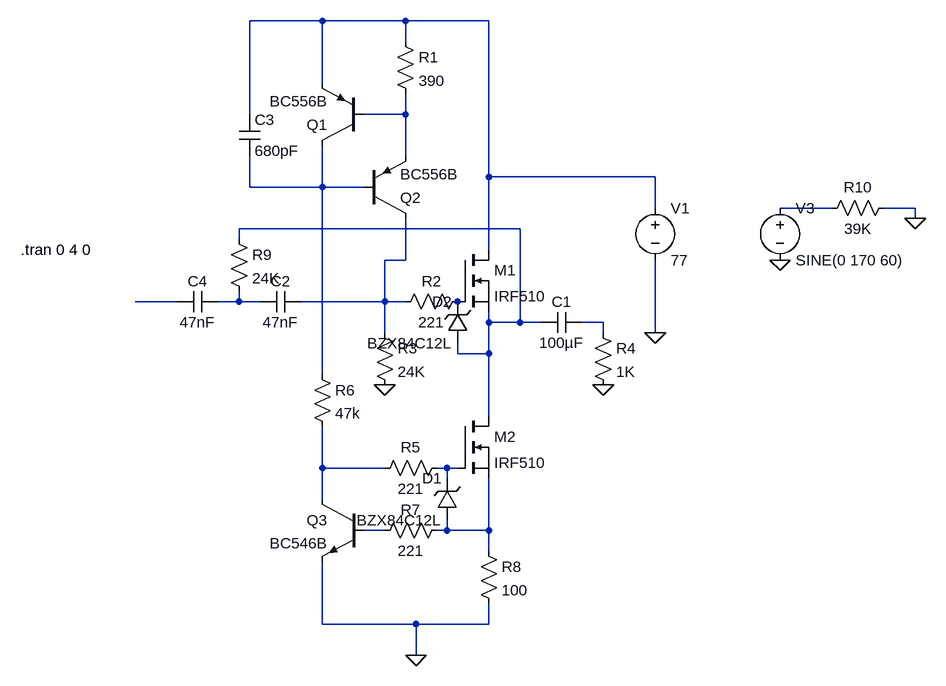
[diagram p0: schematic Draft4.asc]
Draft4.asc, the LTspice schematic file:
Version 4
SHEET 1 880 724
WIRE -96 -272 -208 -272
WIRE 32 -272 -96 -272
WIRE 160 -272 32 -272
WIRE 32 -240 32 -272
WIRE -96 -176 -96 -272
WIRE -208 -128 -208 -272
WIRE 32 -128 32 -160
WIRE 32 -128 -32 -128
WIRE 32 -64 32 -128
WIRE 160 -32 160 -272
WIRE 416 -32 160 -32
WIRE -208 -16 -208 -64
WIRE -96 -16 -96 -80
WIRE -96 -16 -208 -16
WIRE -32 -16 -96 -16
WIRE 416 16 416 -32
WIRE 688 16 608 16
WIRE 816 16 768 16
WIRE 816 32 816 16
WIRE 208 48 -224 48
WIRE -224 64 -224 48
WIRE 160 80 160 -32
WIRE 32 96 32 32
WIRE 32 96 0 96
WIRE -320 160 -384 160
WIRE -224 160 -224 144
WIRE -224 160 -256 160
WIRE -192 160 -224 160
WIRE 0 160 0 96
WIRE 0 160 -128 160
WIRE 32 160 0 160
WIRE 160 192 160 176
WIRE 208 192 208 48
WIRE 208 192 160 192
WIRE 240 192 208 192
WIRE 336 192 304 192
WIRE 0 208 0 160
WIRE 336 208 336 192
WIRE 416 208 416 96
WIRE 112 240 112 224
WIRE 160 240 160 192
WIRE 160 240 112 240
WIRE -96 272 -96 -16
WIRE 160 336 160 240
WIRE -96 416 -96 352
WIRE 0 416 -96 416
WIRE 96 416 80 416
WIRE 112 416 96 416
WIRE 96 432 96 416
WIRE -96 464 -96 416
WIRE 0 512 -32 512
WIRE 96 512 96 496
WIRE 96 512 80 512
WIRE 160 512 160 432
WIRE 160 512 96 512
WIRE 160 544 160 512
WIRE -96 656 -96 560
WIRE 48 656 -96 656
WIRE 160 656 160 624
WIRE 160 656 48 656
WIRE 48 704 48 656
FLAG 0 288 0
FLAG 336 288 0
FLAG 416 208 0
FLAG 48 704 0
FLAG 608 96 0
FLAG 816 32 0
SYMBOL nmos 112 80 R0
SYMATTR InstName M1
SYMATTR Value IRF510
SYMBOL voltage 416 0 R0
WINDOW 123 0 0 Left 2
WINDOW 39 0 0 Left 2
SYMATTR InstName V1
SYMATTR Value 77
SYMBOL res 128 144 R90
WINDOW 0 0 56 VBottom 2
WINDOW 3 32 56 VTop 2
SYMATTR InstName R2
SYMATTR Value 221
SYMBOL res -16 192 R0
SYMATTR InstName R3
SYMATTR Value 24K
SYMBOL cap 304 176 R90
WINDOW 0 0 32 VBottom 2
WINDOW 3 32 32 VTop 2
SYMATTR InstName C1
SYMATTR Value 100µF
SYMBOL res 320 192 R0
SYMATTR InstName R4
SYMATTR Value 1K
SYMBOL pnp -32 -80 R180
SYMATTR InstName Q1
SYMATTR Value BC556B
SYMBOL pnp -32 32 M180
SYMATTR InstName Q2
SYMATTR Value BC556B
SYMBOL res 16 -256 R0
SYMATTR InstName R1
SYMATTR Value 390
SYMBOL nmos 112 336 R0
SYMATTR InstName M2
SYMATTR Value IRF510
SYMBOL res 96 400 R90
WINDOW 0 0 56 VBottom 2
WINDOW 3 32 56 VTop 2
SYMATTR InstName R5
SYMATTR Value 221
SYMBOL res 96 496 R90
WINDOW 0 0 56 VBottom 2
WINDOW 3 32 56 VTop 2
SYMATTR InstName R7
SYMATTR Value 221
SYMBOL npn -32 464 M0
SYMATTR InstName Q3
SYMATTR Value BC546B
SYMBOL res 144 528 R0
SYMATTR InstName R8
SYMATTR Value 100
SYMBOL res -112 256 R0
SYMATTR InstName R6
SYMATTR Value 47k
SYMBOL cap -128 144 R90
WINDOW 0 0 32 VBottom 2
WINDOW 3 32 32 VTop 2
SYMATTR InstName C2
SYMATTR Value 47nF
SYMBOL zener 112 496 R180
WINDOW 0 24 64 Left 2
WINDOW 3 24 0 Left 2
SYMATTR InstName D1
SYMATTR Value BZX84C12L
SYMBOL zener 128 224 R180
WINDOW 0 24 64 Left 2
WINDOW 3 24 0 Left 2
SYMATTR InstName D2
SYMATTR Value BZX84C12L
SYMBOL cap -224 -128 R0
SYMATTR InstName C3
SYMATTR Value 680pF
SYMBOL cap -256 144 R90
WINDOW 0 0 32 VBottom 2
WINDOW 3 32 32 VTop 2
SYMATTR InstName C4
SYMATTR Value 47nF
SYMBOL res -240 48 R0
SYMATTR InstName R9
SYMATTR Value 24K
SYMBOL voltage 608 0 R0
WINDOW 123 0 0 Left 2
WINDOW 39 0 0 Left 2
SYMATTR InstName V3
SYMATTR Value SINE(0 170 60)
SYMBOL res 784 0 R90
WINDOW 0 0 56 VBottom 2
WINDOW 3 32 56 VTop 2
SYMATTR InstName R10
SYMATTR Value 39K
TEXT -560 80 Left 2 !.tran 0 4 0

The netlist it stands for:
* Draft4.asc
M1 N001 P001 N005 N005 IRF510
V1 N001 0 77
R2 P001 N006 221
R3 N006 0 24K
C1 N009 N005 100µF
R4 N009 0 1K
Q1 N003 N002 N001 0 BC556B
Q2 N006 N003 N002 0 BC556B
R1 N001 N002 390
M2 N005 N011 N013 N013 IRF510
R5 N011 N010 221
R7 N013 N012 221
Q3 N010 N012 0 0 BC546B
R8 N013 0 100
R6 N003 N010 47k
C2 N006 N008 47nF
D1 N013 N011 BZX84C12L
D2 N005 P001 BZX84C12L
C3 N001 N003 680pF
C4 N008 N007 47nF
R9 N005 N008 24K
V3 N004 0 SINE(0 170 60)
R10 0 N004 39K
.model D D
.lib standard.dio
.model NPN NPN
.model PNP PNP
.lib standard.bjt
.model NMOS NMOS
.model PMOS PMOS
.lib standard.mos
.tran 0 4 0
.backanno
.end